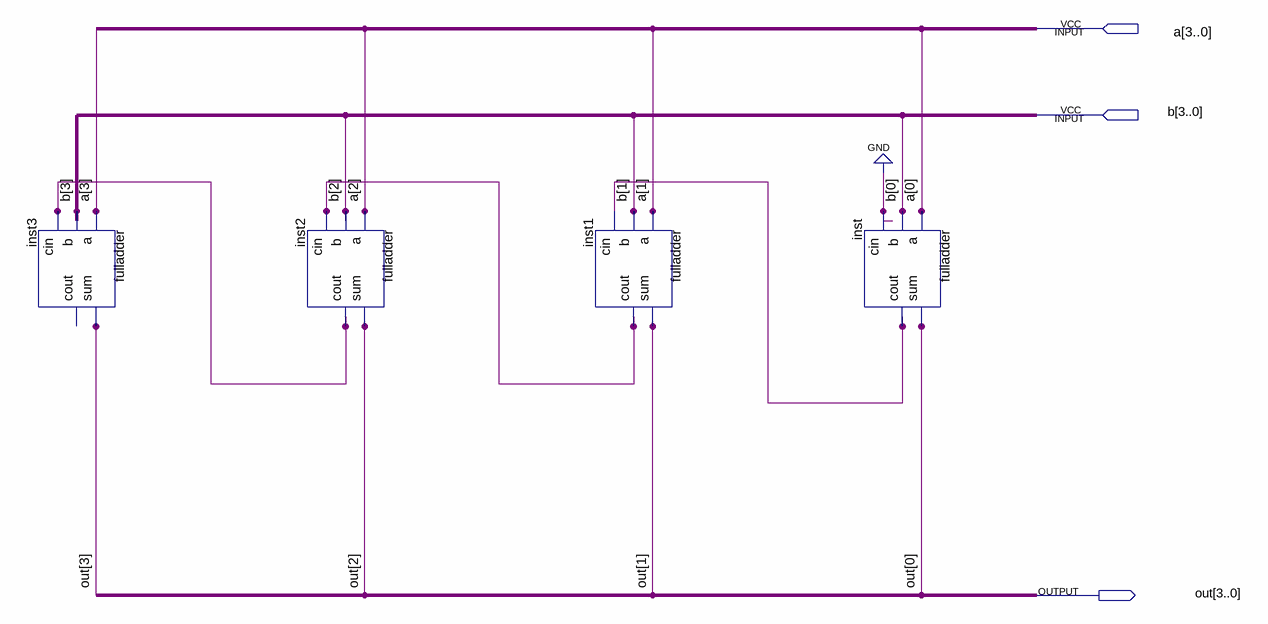
[diagram p0: schematic sheet]
// Quartus schematic adder.bdf as structural Verilog: 4 symbols, 3 pins
module adder (
  input  [3:0] a,
  input  [3:0] b,
  output [3:0] out
);

  wire inst1_cout, inst2_cout, inst3_cout, inst_cout;

  fulladder inst3 (.a(a[3]), .b(b[3]), .cin(inst2_cout), .sum(out[3]), .cout(inst3_cout));
  fulladder inst2 (.a(a[2]), .b(b[2]), .cin(inst1_cout), .sum(out[2]), .cout(inst2_cout));
  fulladder inst1 (.a(a[1]), .b(b[1]), .cin(inst_cout), .sum(out[1]), .cout(inst1_cout));
  fulladder inst (.a(a[0]), .b(b[0]), .cin(1'b0), .sum(out[0]), .cout(inst_cout));
endmodule
